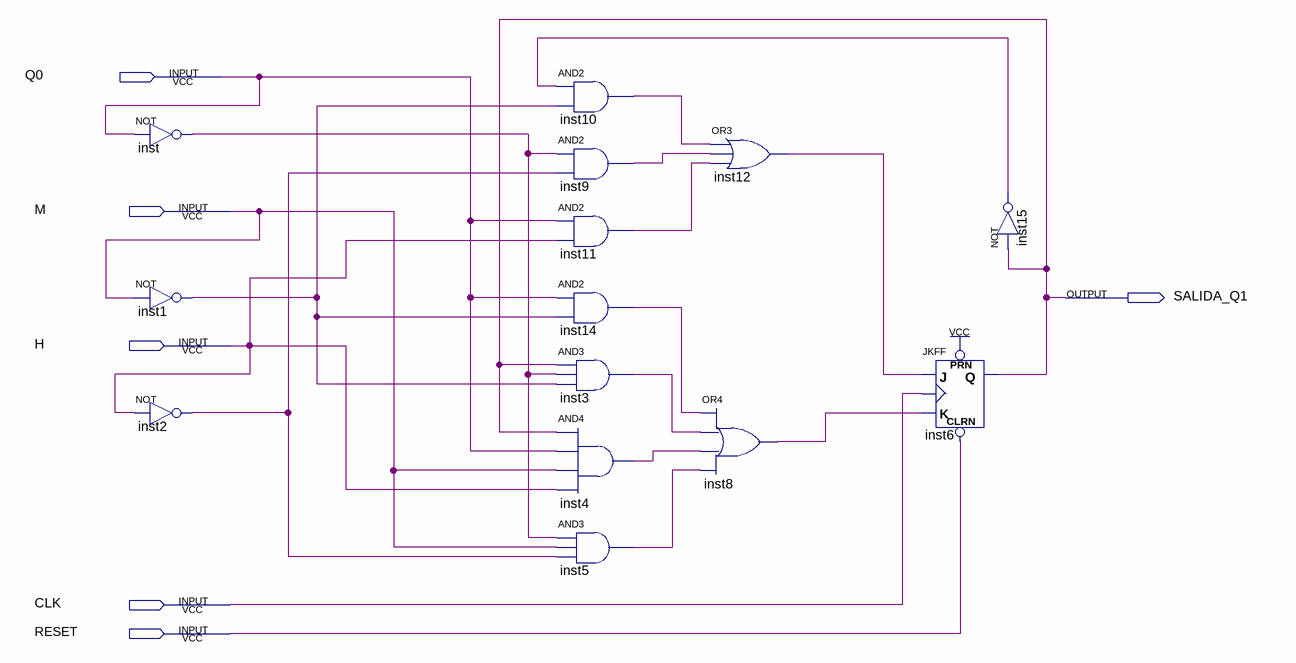
[diagram p0: schematic sheet]
// Quartus schematic FLIPFLOP_JK1.bdf as structural Verilog: 14 symbols, 6 pins
module FLIPFLOP_JK1 (
  input  Q0,
  input  M,
  input  H,
  input  CLK,
  input  RESET,
  output SALIDA_Q1
);

  wire inst1_out, inst2_out, inst3_out, inst4_out, inst5_out, inst8_out, inst9_out, inst10_out, inst11_out,
       inst12_out, inst14_out, inst15_out, inst_out;

  not inst (inst_out, Q0);
  not inst1 (inst1_out, M);
  not inst2 (inst2_out, H);
  and inst10 (inst10_out, inst15_out, inst1_out);
  and inst9 (inst9_out, inst_out, inst2_out);
  and inst11 (inst11_out, Q0, H);
  and inst14 (inst14_out, Q0, inst1_out);
  and inst3 (inst3_out, SALIDA_Q1, inst_out, inst1_out);
  and inst4 (inst4_out, SALIDA_Q1, Q0, M, H);
  and inst5 (inst5_out, inst_out, M, inst2_out);
  or inst12 (inst12_out, inst10_out, inst9_out, inst11_out);
  or inst8 (inst8_out, inst14_out, inst3_out, inst4_out, inst5_out);
  JKFF inst6 (.PRN(1'b1), .CLRN(RESET), .K(inst8_out), .J(inst12_out), .CLK(CLK), .Q(SALIDA_Q1));
  not inst15 (inst15_out, SALIDA_Q1);
endmodule
